# EAGLE design FAIO2_Sip-n-Puff (EAGLE 9.3.0)
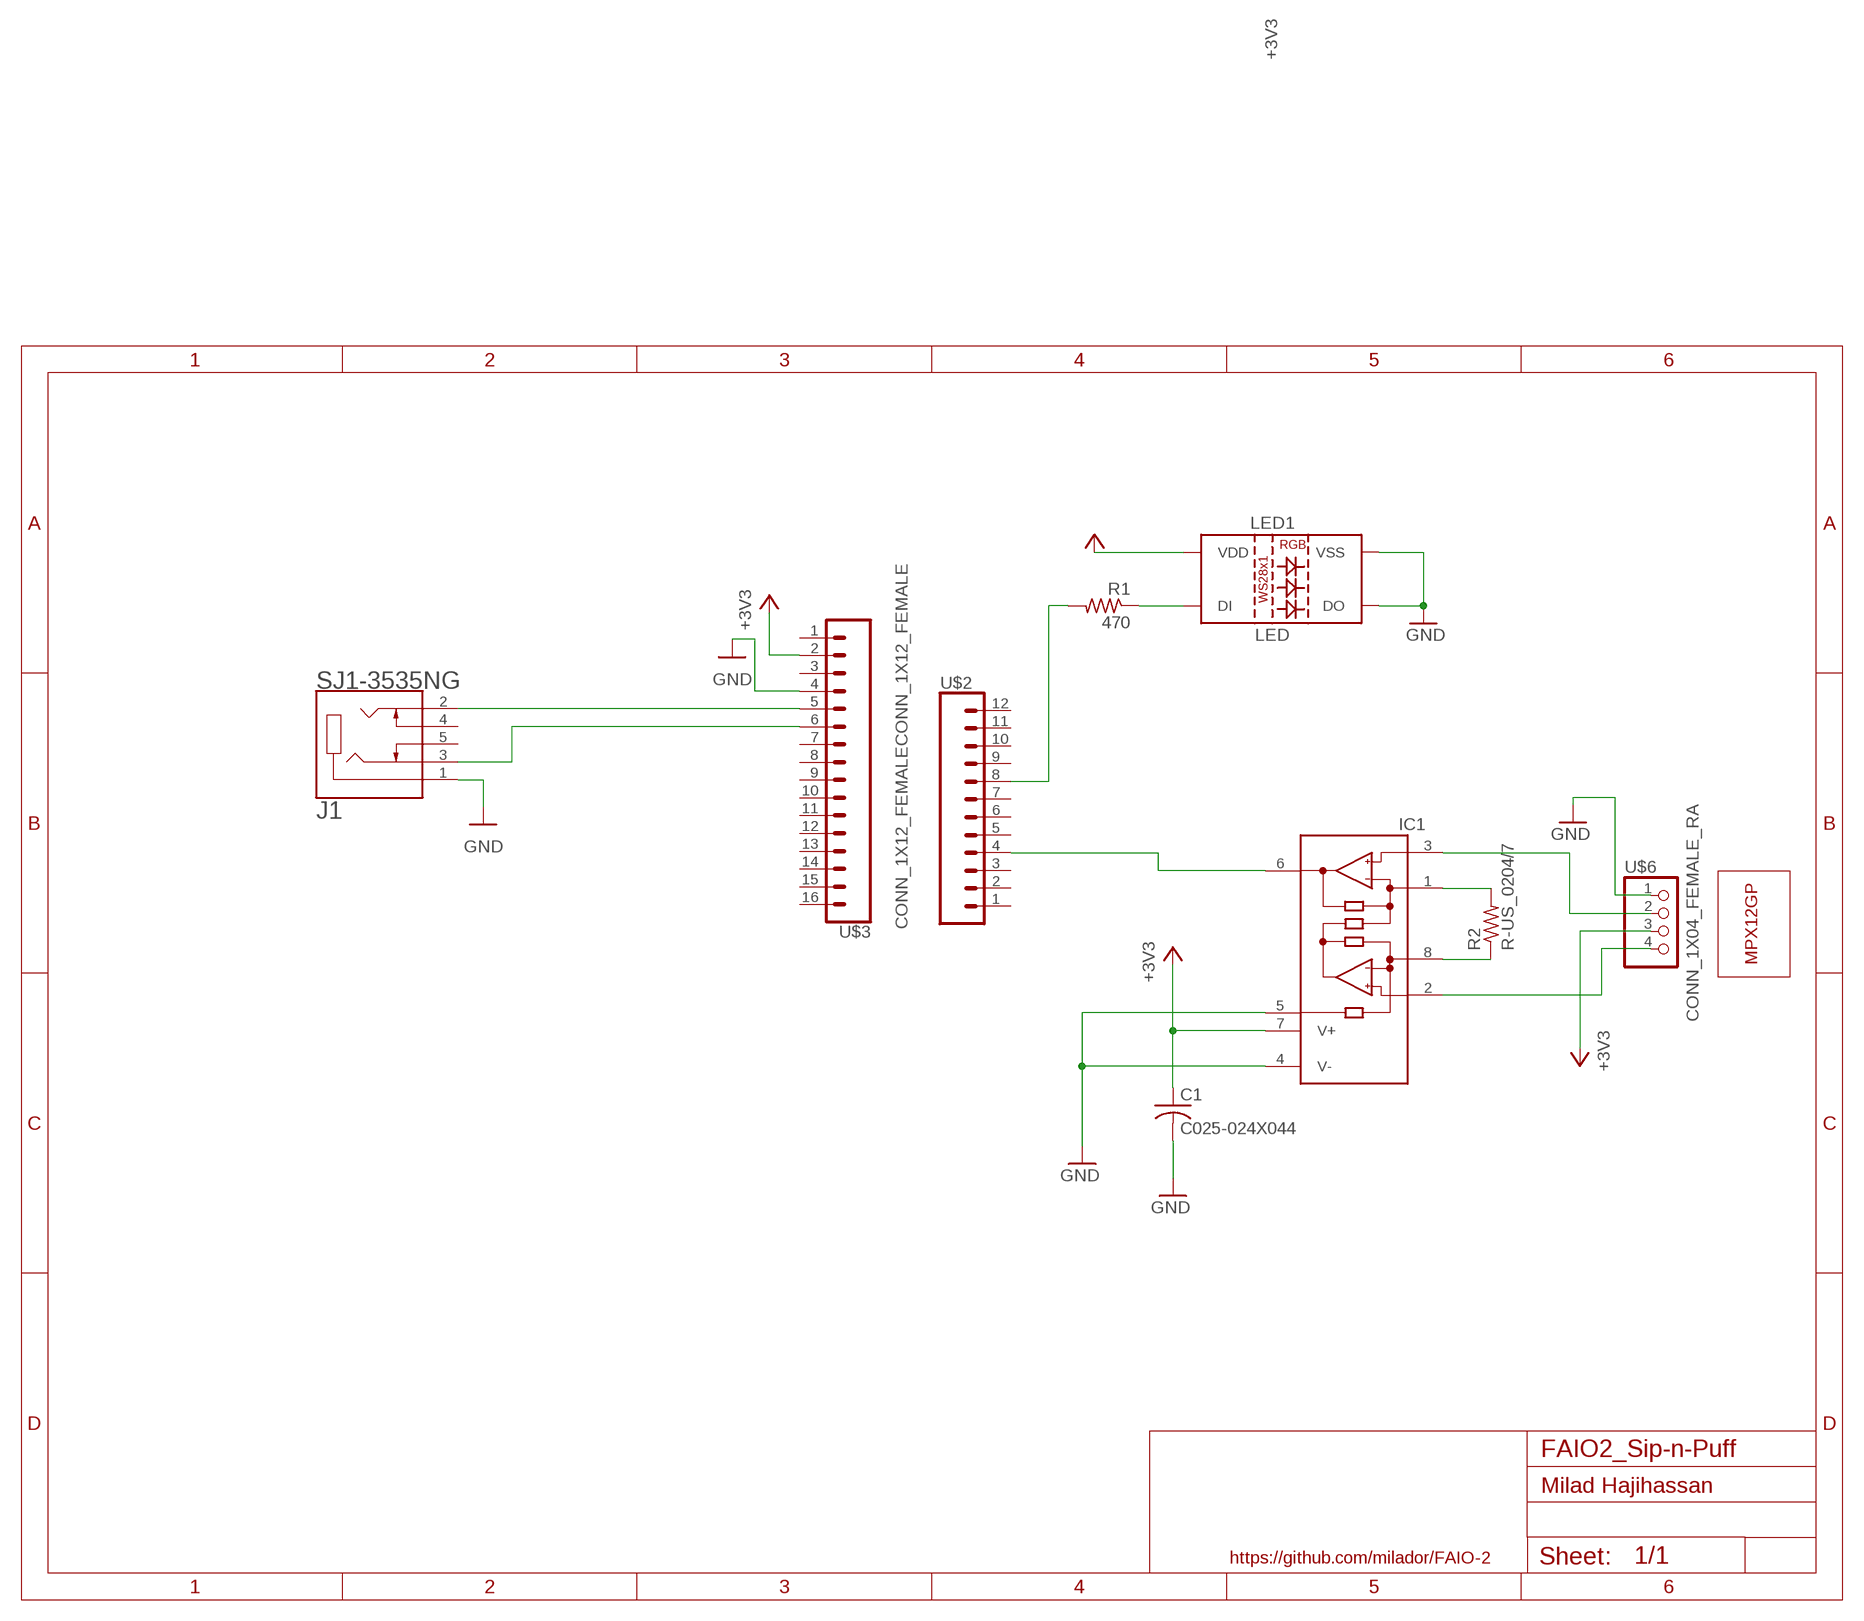
[diagram p0: schematic, sheet 1]

## Parts
C1  C025-024X044  [C025-024X044]
IC1  INA122PDIL08  [DIL08]
J1  SJ1-3535NG  [CUI_SJ1-3535NG]
LED1  LED  NEOPIXELS-5MM  [NEOPIXELS-5MM]
R1  470  R-US_0204/7  [0204/7]
R2  R-US_0204/7  [0204/7]
U$1  MPX12GPMPX12GP  [MPX]
U$2  CONN_1X12_FEMALECONN_1X12_FEMALE  [CONN_1X12]
U$3  CONN_1X16_FEMALECONN_1X16_FEMALE  [CONN_1X16]
U$6  CONN_1X04_FEMALE_RA  [HDRRAR4W64P254_1X4_1066X850X254B]

## Nets
+3V3: C1.1 IC1.7(V+) LED1.2(VDD) U$3.2 U$6.3
GND: C1.2 IC1.4(V-) IC1.5(REF) J1.1 LED1.3(VSS) LED1.4(DO) U$3.4 U$6.1
N$3: IC1.6(OUT) U$2.4
N$4: LED1.1(DI) R1.1
N$5: IC1.1(RG) R2.2
N$6: R1.2 U$2.8
N$9: J1.2 U$3.5
N$10: J1.3 U$3.6
N$15: IC1.8(RG) R2.1
N$17: IC1.3(+IN) U$6.2
N$18: IC1.2(-IN) U$6.4
Unconnected: J1.4 J1.5 U$2.1 U$2.2 U$2.3 U$2.5 U$2.6 U$2.7 U$2.9 U$2.10 U$2.11 U$2.12 U$3.1 U$3.3 U$3.7 U$3.8 U$3.9 U$3.10 U$3.11 U$3.12 U$3.13 U$3.14 U$3.15 U$3.16

## Notes on the sheet
- Milad Hajihassan
- https://github.com/milador/FAIO-2

## Library data of the parts
C1 = milador:C025-024X044
IC1 = milador:INA122P
J1 = milador:SJ1-3535NG: SJ1 Series 3.5 mm 12 V Right Angle Through Hole Isolated Stereo Audio Jack; MANUFACTURER: CUI; PARTREV: 1.02; STANDARD: Manufacturer recommendation
LED1 = milador:NEOPIXELS-5MM: WS2812B PTH addressable RGB LED 5mm PTH LED with built-in controller IC. Color: Red/Green/Blue mC Rating: RGB: 390, 660, 180 mcd Forward Voltage: RGB: 2.0, 3.0, 3.0 V SparkFun Products: LED - RGB Addressable, PTH, 5mm Diffused (5 Pack) <https://www.sparkfun.com/products/12986> LED - RGB Addressable, PTH, 5mm Clear (5 Pack) <https://www.sparkfun.com/products/12999> Datasheet referenced for footprint: WS2812B-PTH <https://cdn.sparkfun.com/datasheets/Components/LED/COM-12877.pdf>
R1 R2 = milador:R-US_0204/7
U$1 = milador:MPX12GP
U$2 = milador:CONN_1X12_FEMALE
U$3 = milador:CONN_1X16_FEMALE
U$6 = milador:CONN_1X04_FEMALE_RA

## Board
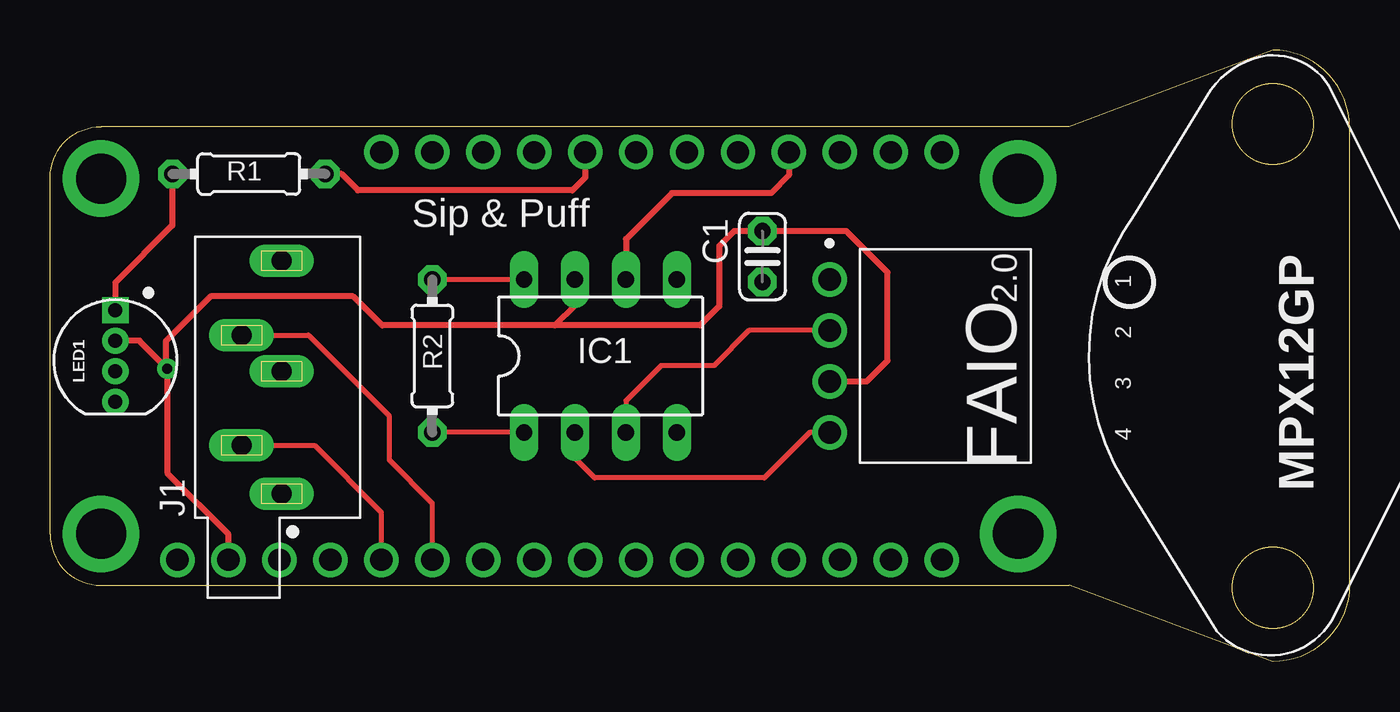
[diagram p1: board, top side]
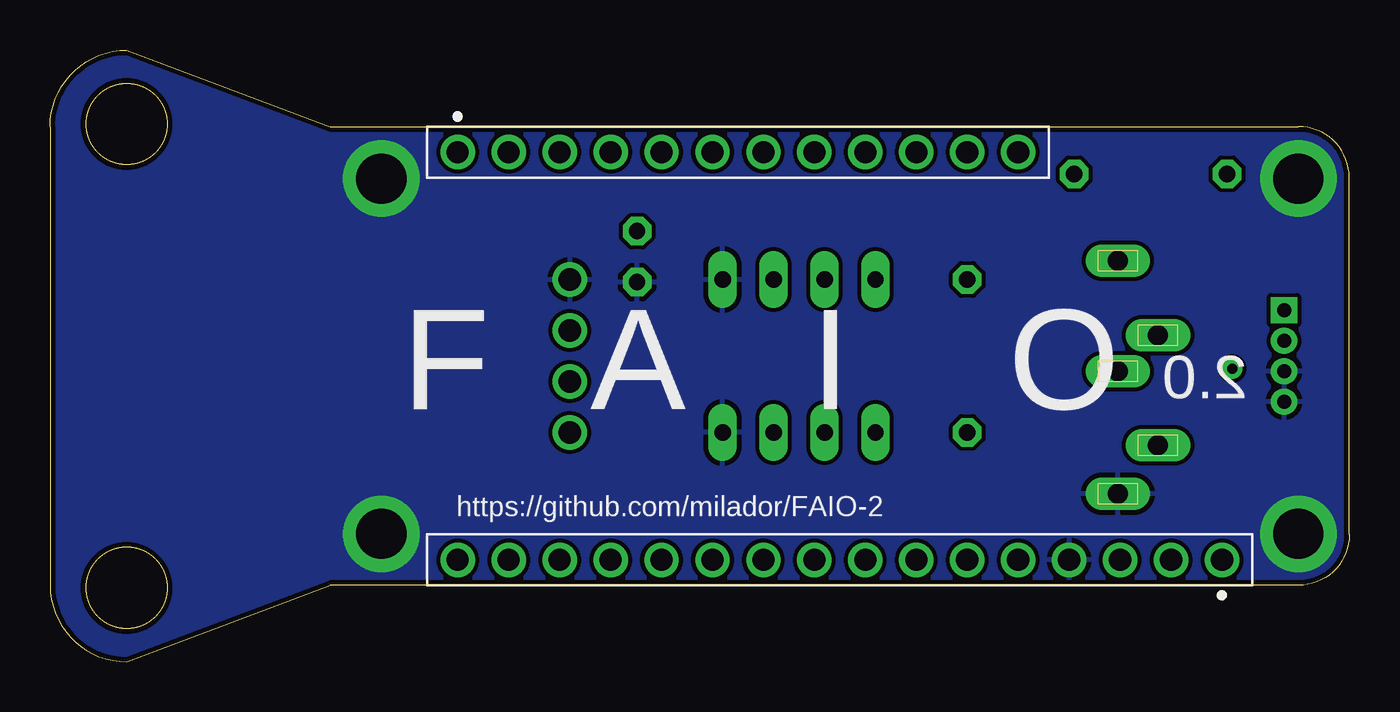
[diagram p2: board, bottom side, seen from below]

Size 64.77 x 30.48 mm. Coordinates in mm from the lower left corner, seen from the top.
Outline: 2.54,3.81 50.8,3.81 60.96,0 arc90 64.77,3.81 64.77,26.67 arc90 60.96,30.48 50.8,26.67 2.54,26.67 arc90 0,24.13 0,6.35 arc90 2.54,3.81
Copper layers (1*16): Top 0.035mm / dielectric 1.5mm / Bottom 0.035mm
Design rules "SparkFun": minimum track width 8mil, minimum drill 20mil, track to track 8mil, track to pad 8mil, pad to pad 8mil, via to via 8mil, smd to smd 8mil, copper to edge 10mil, drill to drill 8mil, minimum pad ring 12mil, minimum via ring 10mil, stop-mask expansion 4mil, vias tented up to drill 25mil, thermal gap 10mil

### Footprints (pad centres in the part's own frame; a part is rotated, then mirrored left to right if it is on the bottom)
C025-024X044 = drill 0.813 octagon: 1 -1.27,0; 2 1.27,0
DIL08 = drill 0.813 long: 1 -3.81,-3.81; 2 -1.27,-3.81; 3 1.27,-3.81; 4 3.81,-3.81; 5 3.81,3.81; 6 1.27,3.81; 7 -1.27,3.81; 8 -3.81,3.81
CUI_SJ1-3535NG = drill 1 long: 1 0,0; 2 2.4,2; 3 7.9,2; 4 11.6,0; 5 6.1,0
NEOPIXELS-5MM = drill 0.7 pad 1.016 square: 1 2.28,0 | drill 0.7 pad 1.016: 2 0.76,0; 3 -0.76,0; 4 -2.28,0
0204/7 = drill 0.813 octagon: 1 -3.81,0; 2 3.81,0
CONN_1X12 = drill 1.105 pad 1.705: 1 0,0; 2 2.54,0; 3 5.08,0; 4 7.62,0; 5 10.16,0; 6 12.7,0; 7 15.24,0; 8 17.78,0; 9 20.32,0; 10 22.86,0; 11 25.4,0; 12 27.94,0
CONN_1X16 = drill 1.105 pad 1.705: 1 0,0; 2 2.54,0; 3 5.08,0; 4 7.62,0; 5 10.16,0; 6 12.7,0; 7 15.24,0; 8 17.78,0; 9 20.32,0; 10 22.86,0; 11 25.4,0; 12 27.94,0; 13 30.48,0; 14 33.02,0; 15 35.56,0; 16 38.1,0
HDRRAR4W64P254_1X4_1066X850X254B = drill 1.105 pad 1.705: 1 7.62,0; 2 5.08,0; 3 2.54,0; 4 0,0

### Placement (x,y rotation side)
C1  35.51,20.19 270 top
IC1  27.43,15.24 0 top
J1  11.54,8.38 90 top
LED1  3.25,15.24 90 top
R1  9.91,24.31 0 top
R2  19.05,15.24 270 top
U$1  60.96,15.24 270 top
U$2  44.45,25.4 0 bottom
U$3  6.35,5.08 180 bottom
U$6  38.86,11.43 90 top

### Tracks (layer width: path | path; a pad name or v marks a point on that pad's centre or on a via)
+3V3  (via drill 0.51)
  Top 0.305: U$3.2 8.89,6.35 5.84,9.4 v5.84,14.61 5.77,14.68 | 5.77,14.68 4.45,16 LED1.2 | 5.77,14.68 5.77,15.98 8,18.21 15.1,18.21 16.55,16.76 25.15,16.76 | 25.15,16.76 32.4,16.76 33.35,17.71 33.35,20.71 34.1,21.46 C1.1 39.7,21.46 41.75,19.41 41.75,15.01 40.71,13.97 U$6.3 | IC1.7 26.16,17.77 25.15,16.76
GND  (via drill 2.5 pad 3.81)
  other vias: 48.26,6.38 48.26,24.08 2.54,24.08 2.54,6.38
  pour Bottom: -0.25,26.92 -0.25,3.56 50.8,3.56 60.96,-0.25 arc90 65.02,3.56 65.02,26.92 arc90 60.96,30.73 50.8,26.92
N$3
  Top 0.305: U$2.4 36.83,24.24 35.95,23.36 31,23.36 28.7,21.06 IC1.6
N$4
  Top 0.305: LED1.1 3.25,18.9 6.1,21.74 R1.1
N$5
  Top 0.254: IC1.1 R2.2
N$6
  Top 0.305: U$2.8 26.67,24.13 26.04,23.49 15.34,23.49 14.53,24.31 R1.2
N$9
  Top 0.254: J1.2 13.18,10.78 16.51,7.45 U$3.5
N$10
  Top 0.254: J1.3 12.88,16.28 16.9,12.26 16.9,10.06 19.05,7.91 U$3.6
N$15
  Top 0.254: IC1.8 R2.1
N$17
  Top 0.254: U$6.2 34.85,16.51 33.1,14.76 30.45,14.76 28.7,13.01 IC1.3
N$18
  Top 0.254: IC1.2 26.16,10.15 27.15,9.16 35.6,9.16 37.87,11.43 U$6.4

### Text on the board
tNames: Sip & Puff | 2.0 | FAIO
bNames: 2.0 | O | I | A | F | https://github.com/milador/FAIO-2